# Altium schematic sheet Quid_Sch_2023-09-17.schdoc
size 308 x 211 mm
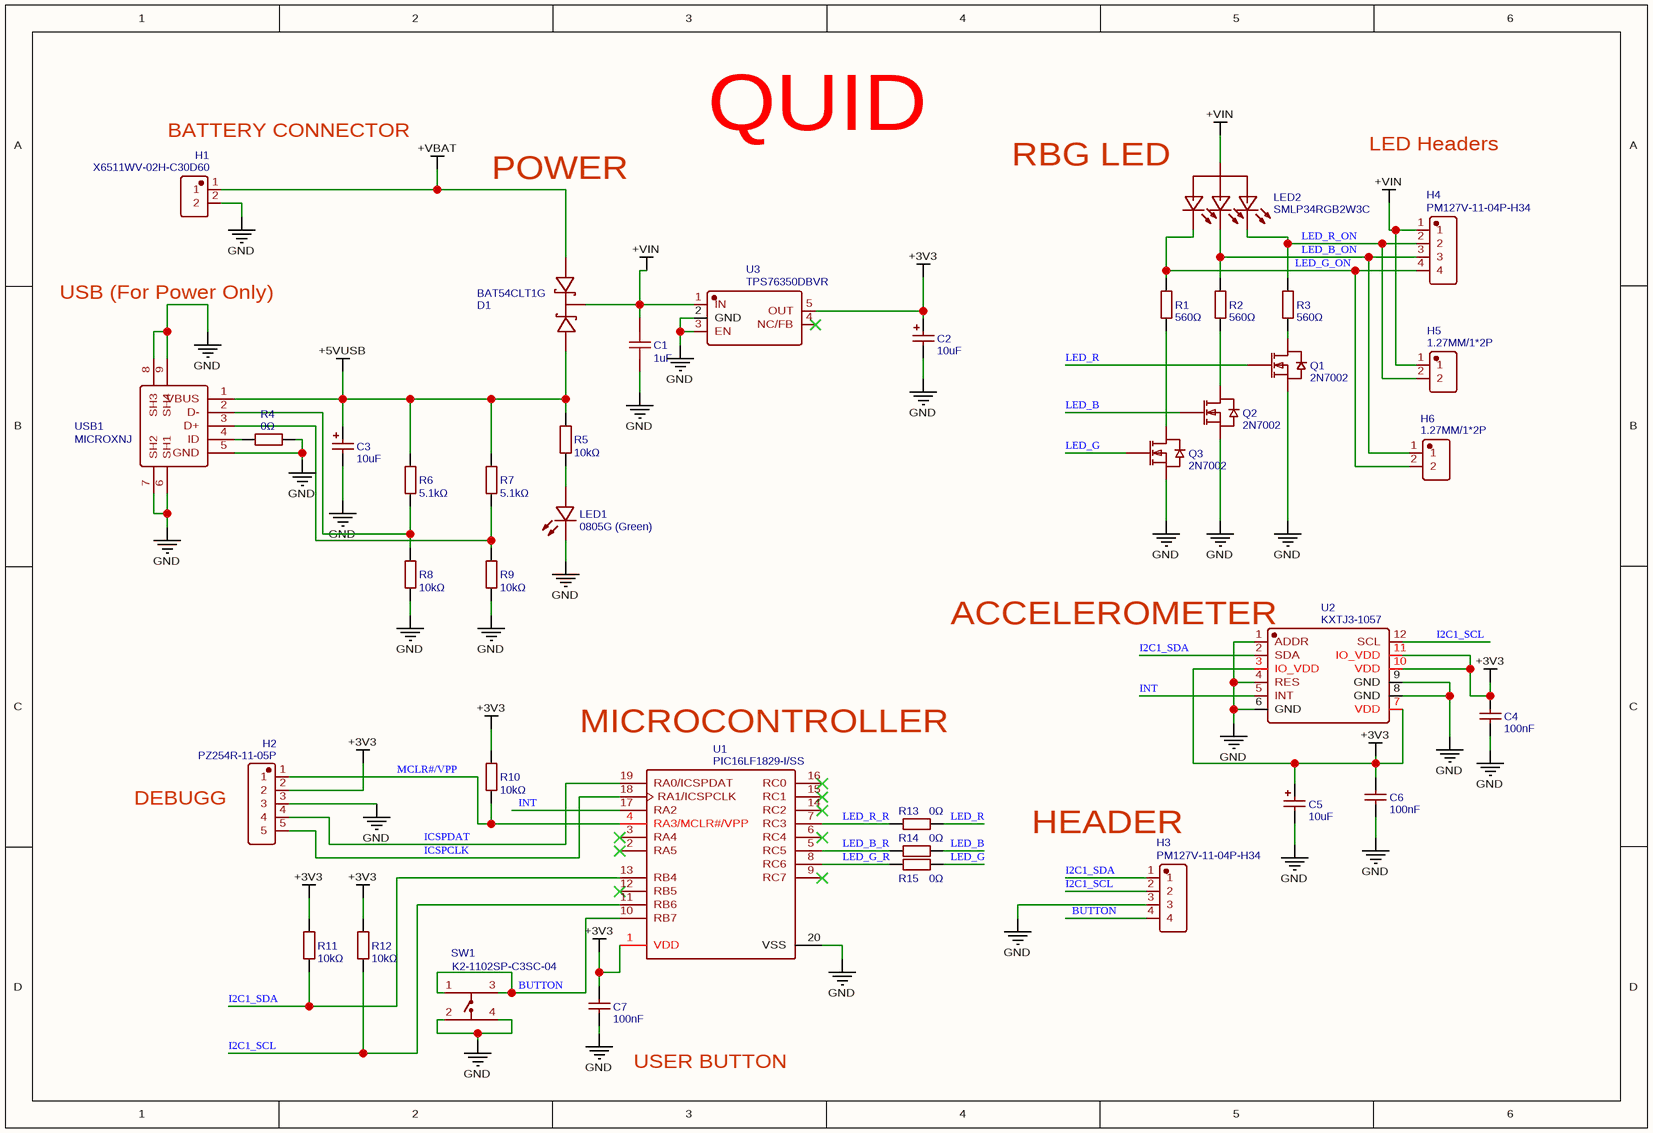
[diagram p0: Quid_Sch_2023-09-17.schdoc]

## Parts
C1  1uF  [C0402]
C2  10uF  [CAP-SMD_L3.2-W1.6-RD-C7171]
C3  10uF  [CAP-SMD_L3.2-W1.6-RD-C7171]
C4  100nF  [C0402]
C5  10uF  [CAP-SMD_L3.2-W1.6-RD-C7171]
C6  100nF  [C0402]
C7  100nF  [C0402]
D1  BAT54CLT1G  [SOT-23-3_L2.9-W1.6-P1.90-LS2.8-BR]
H1  X6511WV-02H-C30D60  [HDR-TH_2P-P2.54-V-M]
H2  PZ254R-11-05P  [HDR-TH_5P-P2.54-H-M-W10.4]
H3  PM127V-11-04P-H34  [HDR-TH_4P-P1.27-V-F]
H4  PM127V-11-04P-H34  [HDR-TH_4P-P1.27-V-F]
H5  1.27MM/1*2P  [HDR-TH_2P-P1.27-V-M]
H6  1.27MM/1*2P  [HDR-TH_2P-P1.27-V-M]
LED1  0805G (Green)  [LED0805-R-RD]
LED2  SMLP34RGB2W3C  [LED-ARRAY-SMD_4P-L1.00-W1.00-TR]
Q1  2N7002  [SOT-23-3_L2.9-W1.3-P1.90-LS2.4-BR]
Q2  2N7002  [SOT-23-3_L2.9-W1.3-P1.90-LS2.4-BR]
Q3  2N7002  [SOT-23-3_L2.9-W1.3-P1.90-LS2.4-BR]
R1  560Ω  [R0402]
R2  560Ω  [R0402]
R3  560Ω  [R0402]
R4  0Ω  [R0402]
R5  10kΩ  [R0402]
R6  5.1kΩ  [R0402]
R7  5.1kΩ  [R0402]
R8  10kΩ  [R0402]
R9  10kΩ  [R0402]
R10  10kΩ  [R0402]
R11  10kΩ  [R0402]
R12  10kΩ  [R0402]
R13  0Ω  [R0402]
R14  0Ω  [R0402]
R15  0Ω  [R0402]
SW1  K2-1102SP-C3SC-04  [SW-SMD_4P-L6.0-W6.0-P4.50-LS9.0]
U1  PIC16LF1829-I/SS  [SSOP-20_L7.2-W5.3-P0.65-LS7.8-BL]
U2  KXTJ3-1057  [LGA-12_L2.0-W2.0-P0.50-BL]
U3  TPS76350DBVR  [SOT-23-5_L3.0-W1.7-P0.95-LS2.8-BR]
USB1  MICROXNJ  [MICRO-USB-SMD_MICROXNJ]

## Nets
+3V3: C2.1 C4.2 C5.1 C6.2 C7.2 H2.2 R10.2 R11.2 R12.2 U1.1(VDD) U2.3(IO_VDD) U2.7(VDD) U2.10(VDD) U2.11(IO_VDD) U3.5(OUT)
+5VUSB: C3.1 D1.2(A) R5.2 R6.2 R7.2 USB1.1(VBUS)
+VBAT: D1.1(A) H1.1
+VIN: C1.2 D1.3(K) H4.1 H5.1 LED2.1(COM) U3.1(IN)
GND: C1.1 C2.2 C3.2 C4.1 C5.2 C6.1 C7.1 H1.2 H2.3 H3.3 LED1.2(K) Q1.2(S) Q2.2(S) Q3.2(S) R4.2 R8.1 R9.1 SW1.2 SW1.4 U1.20(VSS) U2.1(ADDR) U2.4(RES) U2.6(GND) U2.8(GND) U2.9(GND) U3.2(GND) U3.3(EN) USB1.5(GND) USB1.6(SH1) USB1.7(SH2) USB1.8(SH3) USB1.9(SH4)
BUTTON: H3.4 SW1.1 SW1.3 U1.10(RB7)
I2C1_SCL: H3.2 R12.1 U1.11(RB6) U2.12(SCL)
I2C1_SDA: H3.1 R11.1 U1.13(RB4) U2.2(SDA)
ICSPCLK: H2.5 U1.18(RA1/ICSPCLK)
ICSPDAT: H2.4 U1.19(RA0/ICSPDAT)
INT: U1.17(RA2) U2.5(INT)
LED_B: Q2.1(G) R14.2
LED_B_ON: H4.3 H6.1 LED2.3(B-) R2.2
LED_B_R: R14.1 U1.5(RC5)
LED_G: Q3.1(G) R15.2
LED_G_ON: H4.4 H6.2 LED2.4(G-) R1.2
LED_G_R: R15.1 U1.8(RC6)
LED_R: Q1.1(G) R13.2
LED_R_ON: H4.2 H5.2 LED2.2(R-) R3.2
LED_R_R: R13.1 U1.7(RC3)
MCLR#/VPP: H2.1 R10.1 U1.4(RA3/MCLR#/VPP)
NetLED1_1: LED1.1(A) R5.1
NetQ1_3: Q1.3(D) R3.1
NetQ2_3: Q2.3(D) R2.1
NetQ3_3: Q3.3(D) R1.1
NetR4_1: R4.1 USB1.4(ID)
NetR6_1: R6.1 R8.2 USB1.2(D-)
NetR7_1: R7.1 R9.2 USB1.3(D+)

Not connected (* = marked no-connect by the designer): U1 2(RA5)* 3(RA4)* 6(RC4)* 9(RC7)* 12(RB5)* 14(RC2)* 15(RC1)* 16(RC0)*; U3 4(NC/FB)*

## Notes on the sheet
- (near H1) BATTERY CONNECTOR
- POWER
- QUID
- RBG LED
- LED Headers
- USB (For Power Only)
- ACCELEROMETER
- (near U1) MICROCONTROLLER
- DEBUGG
- (near H3) HEADER
- (near C7) USER BUTTON

## Library data of the parts
C1 = 1uF: Manufacturer: SAMSUNG(三星); Manufacturer Part: CL05A105KA5NQNC; nameAlias: Value; Supplier: LCSC; Supplier Part: C52923; JLCPCB Part Class: Basic Part; link: https://lcsc.com/eda_search?q=C52923&%26type=1&ref=editor; spicePre: C; spiceSymbolName: CL05A105KA5NQNC
C2 C3 C5 = 10uF: Manufacturer: Kyocera AVX; Manufacturer Part: TAJA106K016RNJ; nameAlias: Value; Supplier: LCSC; Supplier Part: C7171; JLCPCB Part Class: Basic Part; link: https://lcsc.com/eda_search?q=C7171&%26type=1&ref=editor; spicePre: C; spiceSymbolName: TAJA106K016RNJ
C4 C6 C7 = 100nF: Manufacturer Part: CL05B104KO5NNNC; Manufacturer: SAMSUNG(三星); nameAlias: Value; Supplier: LCSC; Supplier Part: C1525; JLCPCB Part Class: Basic Part; link: https://lcsc.com/eda_search?q=C1525&%26type=1&ref=editor; spicePre: C; spiceSymbolName: CL05B104KO5NNNC
D1 = BAT54CLT1G: Manufacturer: onsemi(安森美); Supplier: LCSC; Manufacturer Part: BAT54CLT1G; Supplier Part: C14308; JLCPCB Part Class: Extended Part; link: https://lcsc.com/eda_search?q=C14308&%26type=1&ref=editor; spicePre: D; spiceSymbolName: BAT54CLT1G
H1 = X6511WV-02H-C30D60: Manufacturer: XKB Connectivity(中国星坤); Manufacturer Part: X6511WV-02H-C60D30; Contributor: LCSC; Supplier: LCSC; Supplier Part: C706874; JLCPCB Part Class: Extended Part; link: https://lcsc.com/eda_search?q=C706874&%26type=1&ref=editor; spicePre: H; spiceSymbolName: X6511WV-02H-C30D60
H2 = PZ254R-11-05P: Manufacturer: XFCN; Contributor: LCSC; Supplier: LCSC; Supplier Part: C492413; Manufacturer Part: PZ254R-11-05P; JLCPCB Part Class: Extended Part; link: https://lcsc.com/eda_search?q=C492413&%26type=1&ref=editor; spicePre: H; spiceSymbolName: PZ254R-11-05P
H3 H4 = PM127V-11-04P-H34: Manufacturer: XFCN(兴飞); Contributor: LCSC; Supplier: LCSC; Supplier Part: C492398; Manufacturer Part: PM127V-11-04P-H34; JLCPCB Part Class: Extended Part; link: https://lcsc.com/eda_search?q=C492398&%26type=1&ref=editor; spicePre: H; spiceSymbolName: PM127V-11-04P-H34
H5 H6 = 1.27MM/1*2P: Manufacturer: BOOMELE(博穆精密); Manufacturer Part: 1.27-1*2P针; Contributor: LCSC; Supplier: LCSC; Supplier Part: C703015; JLCPCB Part Class: Extended Part; link: https://lcsc.com/eda_search?q=C703015&%26type=1&ref=editor; spicePre: H; spiceSymbolName: 1.27MM/1*2P
LED1 = 0805G (Green): Manufacturer: KENTO; Manufacturer Part: KT-0805翠绿; Supplier: LCSC; Supplier Part: C2297; JLCPCB Part Class: Basic Part; link: https://lcsc.com/eda_search?q=C2297&%26type=1&ref=editor; spicePre: L; spiceSymbolName: 0805G (Green)
LED2 = SMLP34RGB2W3C: Manufacturer: ROHM(罗姆); Contributor: LCSC; Supplier: LCSC; Manufacturer Part: SMLP34RGB2W3C; Supplier Part: C162075; JLCPCB Part Class: Extended Part; link: https://lcsc.com/eda_search?q=C162075&%26type=1&ref=editor; spicePre: L; spiceSymbolName: SMLP34RGB2W3C
Q1-Q3 = 2N7002: Manufacturer: CJ(江苏长电/长晶); Supplier: LCSC; Manufacturer Part: 2N7002; Supplier Part: C8545; JLCPCB Part Class: Basic Part; link: https://lcsc.com/eda_search?q=C8545&%26type=1&ref=editor; spicePre: Q; spiceSymbolName: 2N7002
R1-R3 = 560Ω: Manufacturer: UNI-ROYAL(厚声); Manufacturer Part: 0402WGF5600TCE; nameAlias: Value; Supplier: LCSC; Supplier Part: C25126; JLCPCB Part Class: Extended Part; link: https://lcsc.com/eda_search?q=C25126&%26type=1&ref=editor; spicePre: R; spiceSymbolName: 0402WGF5600TCE
R4 R13-R15 = 0Ω: Manufacturer: UNI-ROYAL(厚声); Manufacturer Part: 0402WGF0000TCE; nameAlias: Value; Supplier: LCSC; Supplier Part: C17168; JLCPCB Part Class: Basic Part; link: https://lcsc.com/eda_search?q=C17168&%26type=1&ref=editor; spicePre: R; spiceSymbolName: 0402WGF0000TCE
R5 R8-R12 = 10kΩ: Manufacturer: UNI-ROYAL(厚声); Manufacturer Part: 0402WGF1002TCE; nameAlias: Value; Supplier: LCSC; Supplier Part: C25744; JLCPCB Part Class: Basic Part; link: https://lcsc.com/eda_search?q=C25744&%26type=1&ref=editor; spicePre: R; spiceSymbolName: 0402WGF1002TCE
R6 R7 = 5.1kΩ: Manufacturer: UNI-ROYAL(厚声); Manufacturer Part: 0402WGF5101TCE; nameAlias: Value; Supplier: LCSC; Supplier Part: C25905; JLCPCB Part Class: Basic Part; link: https://lcsc.com/eda_search?q=C25905&%26type=1&ref=editor; spicePre: R; spiceSymbolName: 0402WGF5101TCE
SW1 = K2-1102SP-C3SC-04: Manufacturer: 韩国韩荣; Contributor: LCSC; Supplier: LCSC; Supplier Part: C707347; Manufacturer Part: K2-1102SP-C3SC-04; JLCPCB Part Class: Extended Part; link: https://lcsc.com/eda_search?q=C707347&%26type=1&ref=editor; spicePre: S; spiceSymbolName: K2-1102SP-C3SC-04
U1 = PIC16LF1829-I/SS: Manufacturer: MICROCHIP(美国微芯); Supplier: LCSC; Manufacturer Part: PIC16LF1829-I/SS; Supplier Part: C59149; JLCPCB Part Class: Extended Part; link: https://lcsc.com/eda_search?q=C59149&%26type=1&ref=editor; spicePre: U; spiceSymbolName: PIC16LF1829-I/SS
U2 = KXTJ3-1057: Manufacturer: ROHM(罗姆); Contributor: LCSC; Supplier: LCSC; Supplier Part: C442603; Manufacturer Part: KXTJ3-1057; JLCPCB Part Class: Extended Part; link: https://lcsc.com/eda_search?q=C442603&%26type=1&ref=editor; spicePre: U; spiceSymbolName: KXTJ3-1057
U3 = TPS76350DBVR: Manufacturer: TI(德州仪器); Contributor: LCSC; Supplier: LCSC; Supplier Part: C194609; Manufacturer Part: TPS76350DBVR; JLCPCB Part Class: Extended Part; link: https://lcsc.com/eda_search?q=C194609&%26type=1&ref=editor; spicePre: U; spiceSymbolName: TPS76350DBVR
USB1 = MICROXNJ: Manufacturer: SHOU HAN(首韩); Contributor: LCSC; Supplier: LCSC; Supplier Part: C404969; Manufacturer Part: MicroXNJ; JLCPCB Part Class: Extended Part; link: https://lcsc.com/eda_search?q=C404969&%26type=1&ref=editor; spicePre: U; spiceSymbolName: MICROXNJ